# EAGLE design 5V Power Supply (EAGLE 9.6.2)
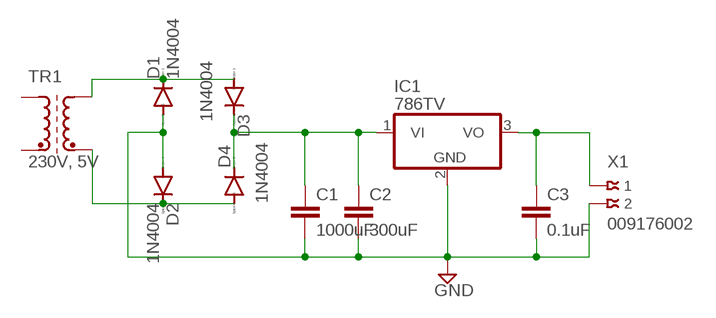
[diagram p0: schematic, sheet 1]

## Parts
C1  1000uF  C2.5/2  [C2.5-2]
C2  300uF  C2.5/2  [C2.5-2]
C3  0.1uF  C2.5/2  [C2.5-2]
D1  1N4004  [DO41-10]
D2  1N4004  [DO41-10]
D3  1N4004  [DO41-10]
D4  1N4004  [DO41-10]
IC1  786TV  [TO220V]
TR1  230V, 5V  SM-T4  [SM-T4]
X1  009176002  [009176002]

## Nets
GND: C1.2 C2.2 C3.2 D1.A D2.A IC1.2(GND) X1.2
N$1: D1.C D3.A TR1.5(A2)
N$3: D2.C D4.A TR1.4(E2)
N$5: C1.1 C2.1 D3.C D4.C IC1.1(VI)
VCC: C3.1 IC1.3(VO) X1.1
Unconnected: TR1.1(A1) TR1.2(E1)

## Library data of the parts
C1-C3 = capacitor-wima:C: CAPACITOR naming: grid - package width
D1-D4 = diode:1N4004: DIODE general purpose rectifier, 1 A
IC1 = linear:78*: Positive VOLTAGE REGULATOR Source: http://cache.national.com/ds/LM/LM78L05.pdf http://www.fairchildsemi.com/ds/LM/LM7805.pdf
TR1 = inductor-neosid:SM-T4: TRANSFORMER SMD wideband transformer; OC_FARNELL: unknown; OC_NEWARK: unknown
X1 = con-avx:00917?002: Wire to Board Strip IDC Connector 2 WAY Source: http://www.avx.com/docs/Catalogs/9176.pdf http://www.avx.com/docs/Catalogs/9177.pdf; MPN: 009176002001006; OC_FARNELL: 1582834; OC_NEWARK: 66M1960

## Board
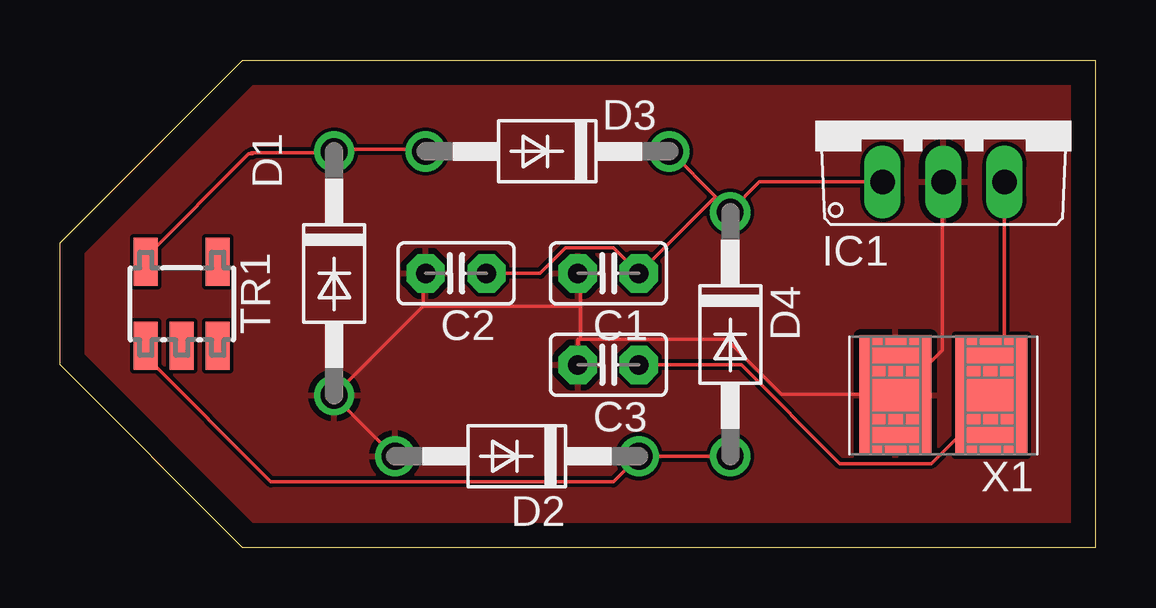
[diagram p1: board, top side]
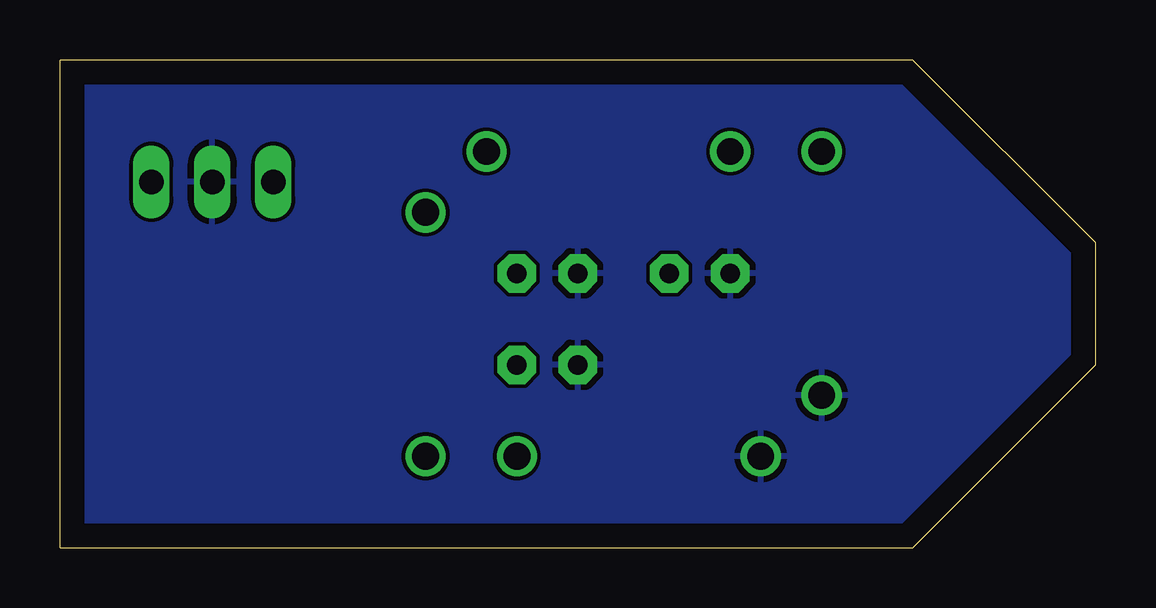
[diagram p2: board, bottom side, seen from below]

Size 43.18 x 20.32 mm. Coordinates in mm from the lower left corner, seen from the top.
Outline: 43.18,0 7.62,0 0,7.62 0,12.7 7.62,20.32 43.18,20.32 43.18,0
Copper layers (1*16): Top 0.035mm / dielectric 1.5mm / Bottom 0.035mm
Design rules "default": minimum track width 6mil, minimum drill 0.35mm, track to track 6mil, track to pad 6mil, pad to pad 6mil, via to via 6mil, smd to smd 6mil, copper to edge 40mil, drill to drill 6mil, minimum pad ring 10mil, minimum via ring 8mil, stop-mask expansion 4mil, vias tented up to drill 0mil, thermal gap 10mil

### Footprints (pad centres in the part's own frame; a part is rotated, then mirrored left to right if it is on the bottom)
C2.5-2 = drill 0.813 pad 1.6 octagon: 1 -1.27,0; 2 1.27,0
DO41-10 = drill 1.118: A 5.08,0; C -5.08,0
TO220V = drill 1.016 long: 1 -2.54,-2.54; 2 0,-2.54; 3 2.54,-2.54
SM-T4 = smd 1 x 2: 1 -1.5,-1.75; 2 -1.5,1.75; 3 0,1.75; 4 1.5,1.75; 5 1.5,-1.75
009176002 = smd 3 x 5: 1 -2,0; 2 2,0

### Placement (x,y rotation side)
C1  22.86,11.43 180 top
C2  16.51,11.43 180 top
C3  22.86,7.62 180 top
D1  11.43,11.43 270 top
D2  19.05,3.81 180 top
D3  20.32,16.51 180 top
D4  27.94,8.89 270 top
IC1  36.83,17.78 0 top
TR1  5.08,10.16 180 top
X1  36.83,6.35 180 top

### Tracks (layer width: path | path; a pad name or v marks a point on that pad's centre or on a via)
GND
  Top 0.152: IC1.2 36.78,15.24 36.78,8.23 34.95,6.4 X1.2 34.8,6.4 30.07,6.4 27.79,8.69 21.69,8.69 | 21.69,10.06 21.69,11.43 C1.2 | 21.69,10.06 21.69,8.69 | 21.69,8.69 21.59,8.69 C3.2 | 15.14,10.06 15.14,11.43 C2.2 | 15.14,10.06 D1.A 11.48,6.25 13.92,3.81 D2.A | 15.14,10.06 21.69,10.06
  pour Bottom: 7.62,20.32 43.18,20.32 43.18,0 7.62,0 0,7.62 0,12.7
  pour Top: 7.62,20.32 43.18,20.32 43.18,0 7.62,0 0,7.62 0,12.7
N$1
  Top 0.152: 8.03,16.46 11.33,16.46 D1.C 11.48,16.61 15.14,16.61 D3.A | 8.03,16.46 7.98,16.46 | 3.58,12.07 TR1.5 3.61,12.14 7.87,16.41 8.03,16.41 8.03,16.46
N$3
  Top 0.152: D4.A D2.C 23.06,2.74 8.79,2.74 3.61,7.92 3.61,8.33 TR1.4
N$5
  Top 0.152: C2.1 20.02,11.43 21.08,12.5 23.06,12.5 C1.1 27.33,14.63 | IC1.1 29.16,15.24 27.94,14.02 | 27.94,14.02 27.33,14.63 | 27.33,14.63 25.5,16.46 D3.C | 27.94,14.02 D4.C
VCC
  Top 0.152: IC1.3 39.37,6.86 38.91,6.4 X1.1 38.76,6.25 38.76,5.94 36.32,3.5 32.51,3.5 28.4,7.62 C3.1